# EAGLE design 2WLS-EXTENDER (EAGLE 7.4.0)
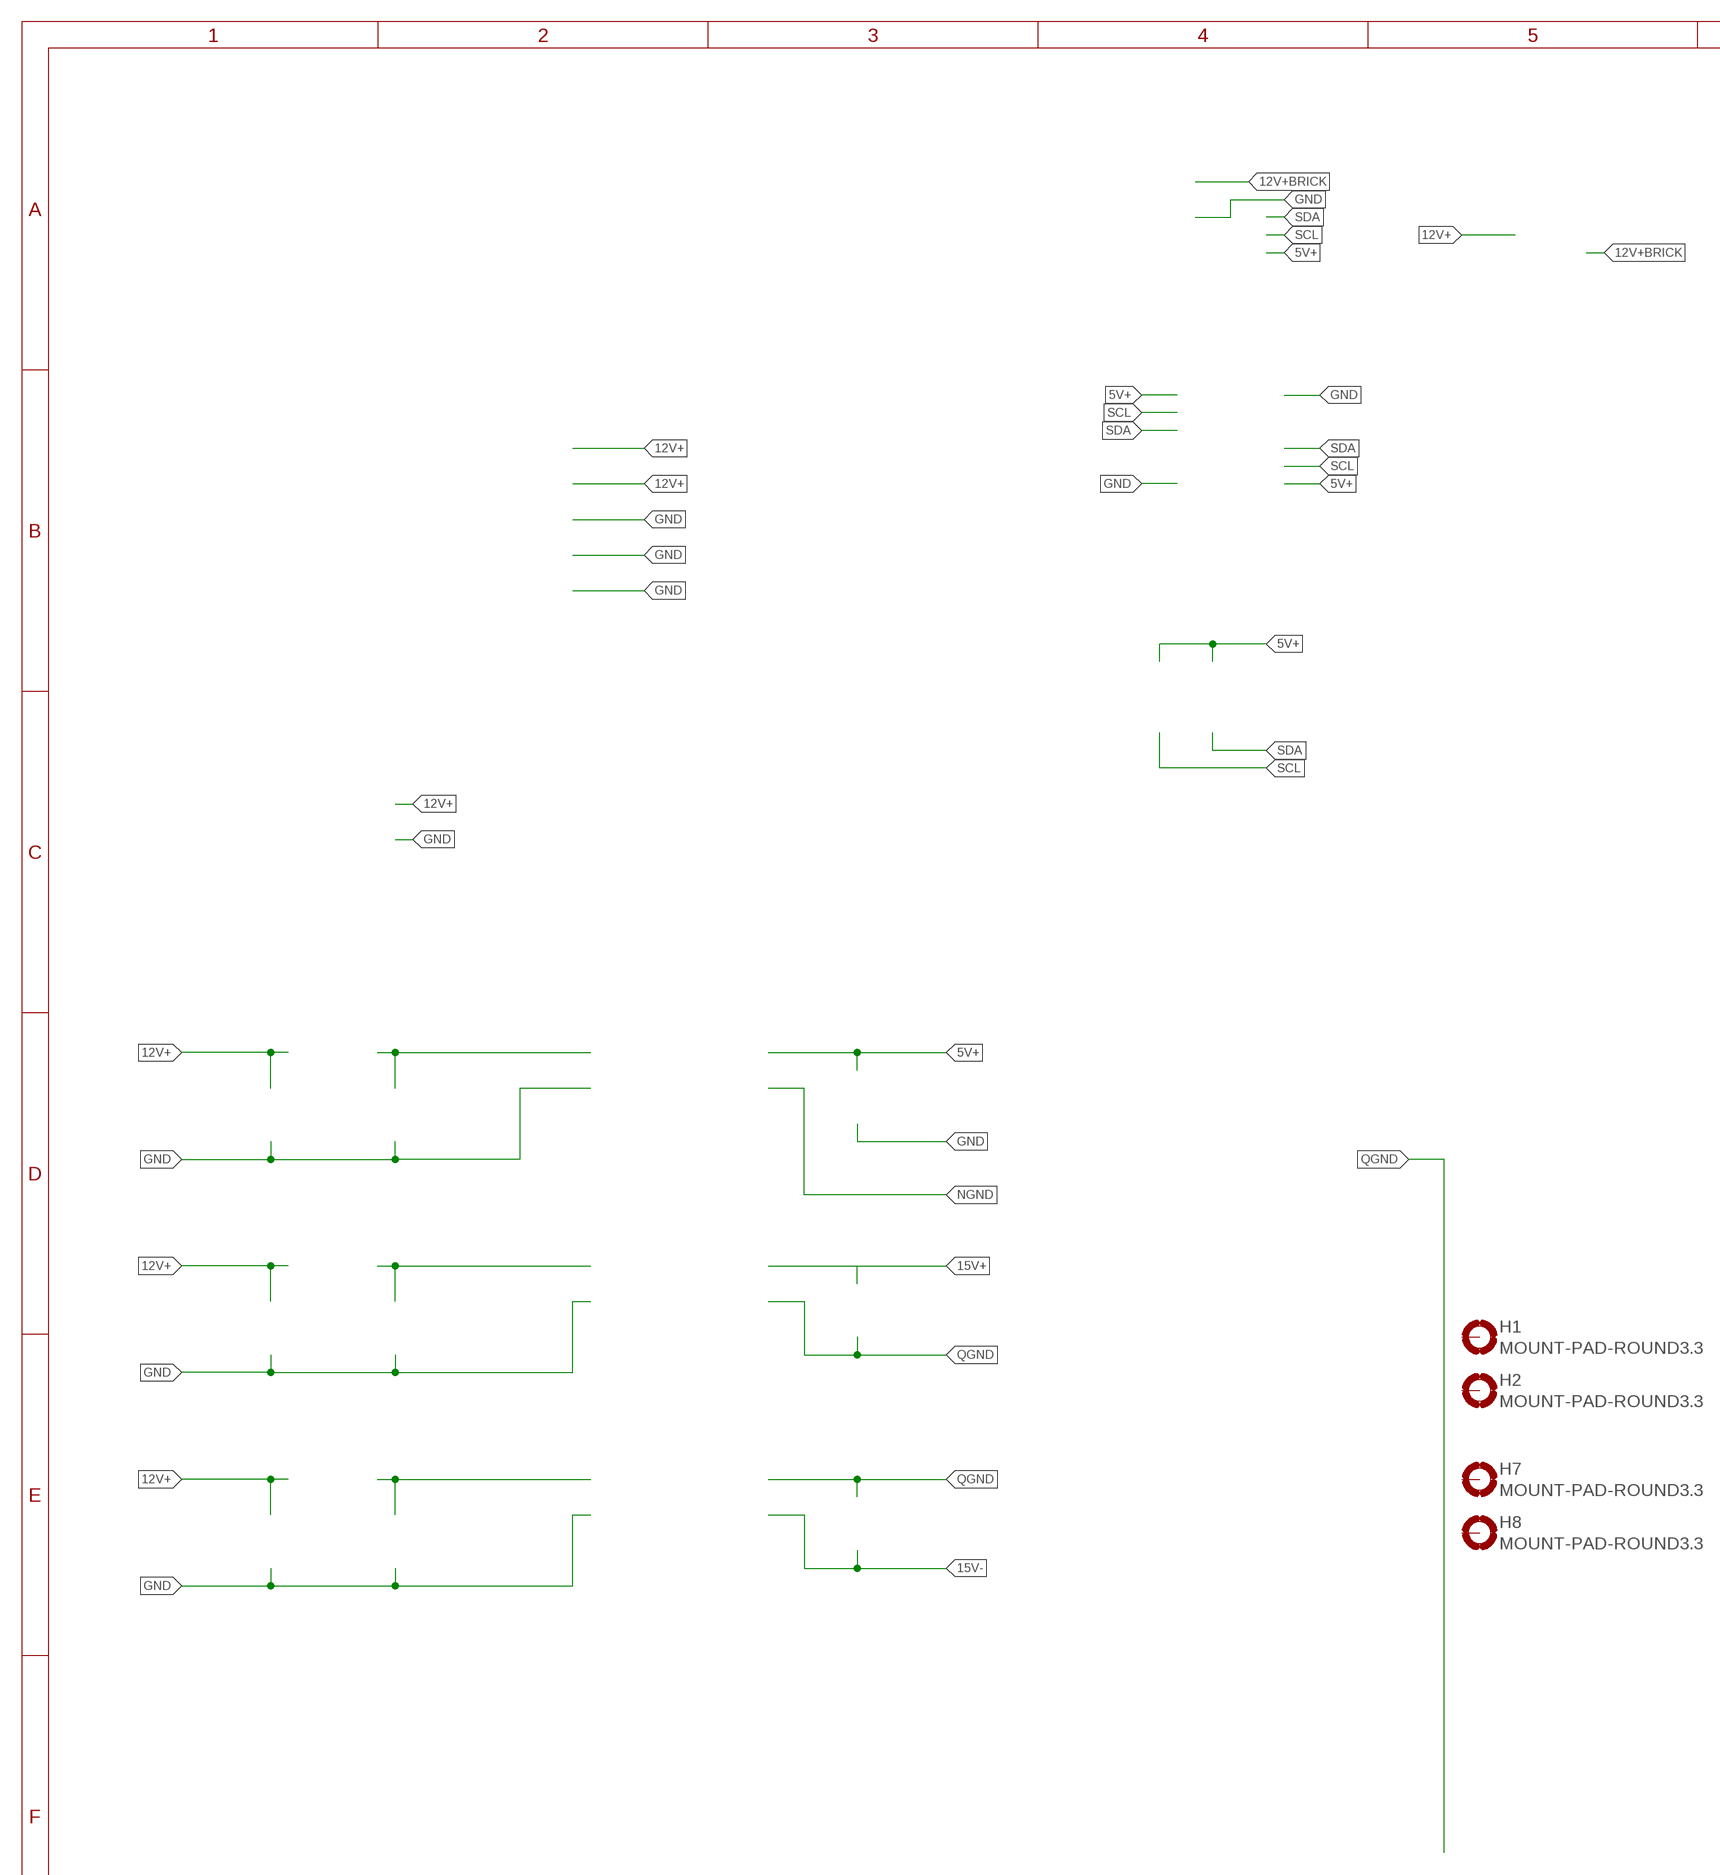
[diagram p0: schematic, sheet 1, part 1 of 2]
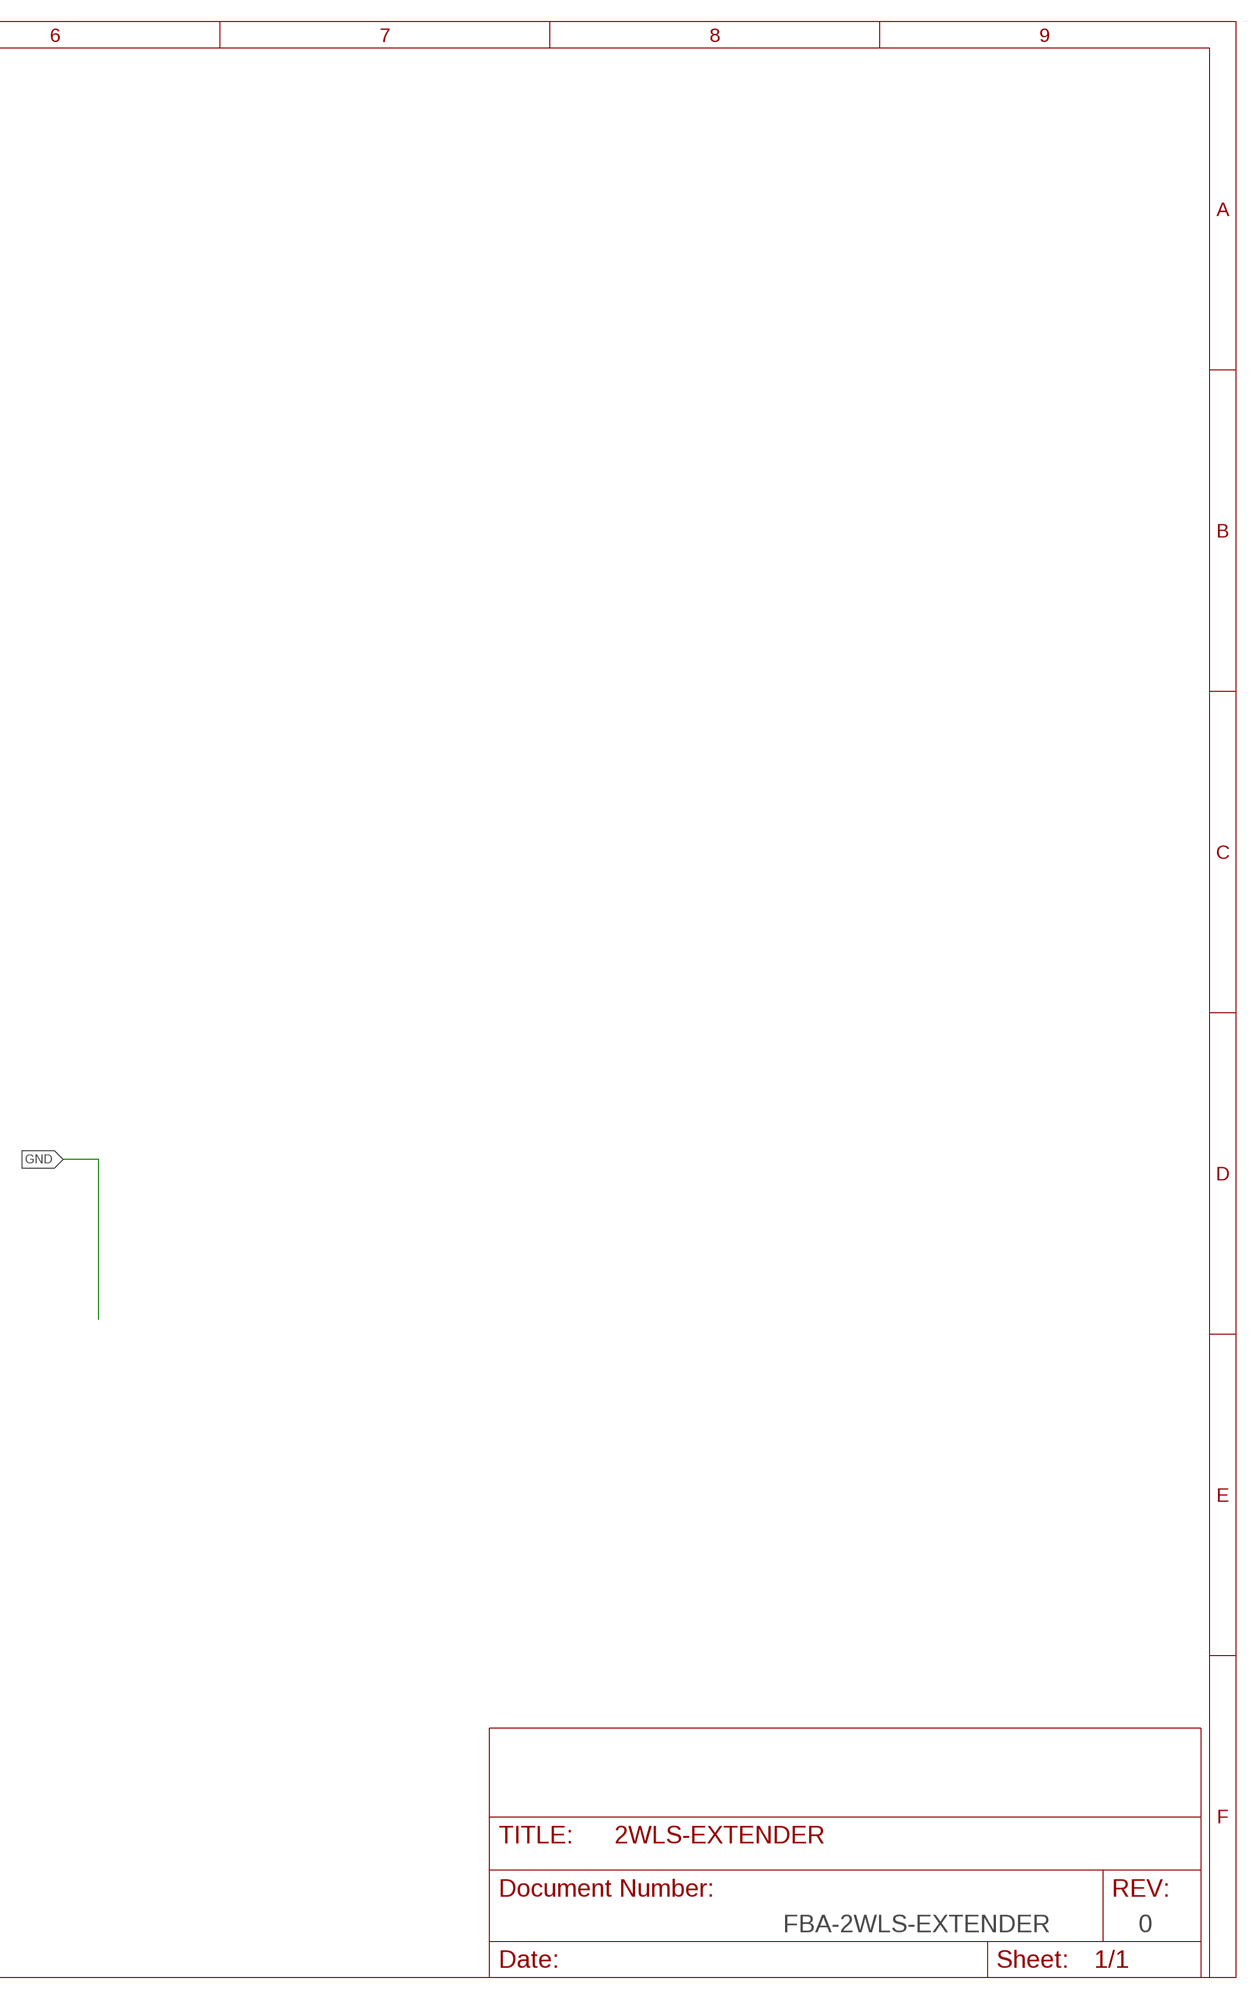
[diagram p1: schematic, sheet 1, part 2 of 2]

## Parts
H1  MOUNT-PAD-ROUND3.3  [3,3-PAD]
H2  MOUNT-PAD-ROUND3.3  [3,3-PAD]
H7  MOUNT-PAD-ROUND3.3  [3,3-PAD]
H8  MOUNT-PAD-ROUND3.3  [3,3-PAD]
Unconnected: H1.B3,3(MOUNT) H2.B3,3(MOUNT) H7.B3,3(MOUNT) H8.B3,3(MOUNT)

## Notes on the sheet
- FBA-2WLS-EXTENDER | 0

## Library data of the parts
H1 H2 H7 H8 = holes:MOUNT-PAD-ROUND: MOUNTING PAD, round

## Net classes
0 Signal: width 0.254 mm, clearance 0.205 mm
1 Power: width 0.508 mm, clearance 0.205 mm to class 0, clearance 0.205 mm
2 GND: width 0.889 mm

## Board
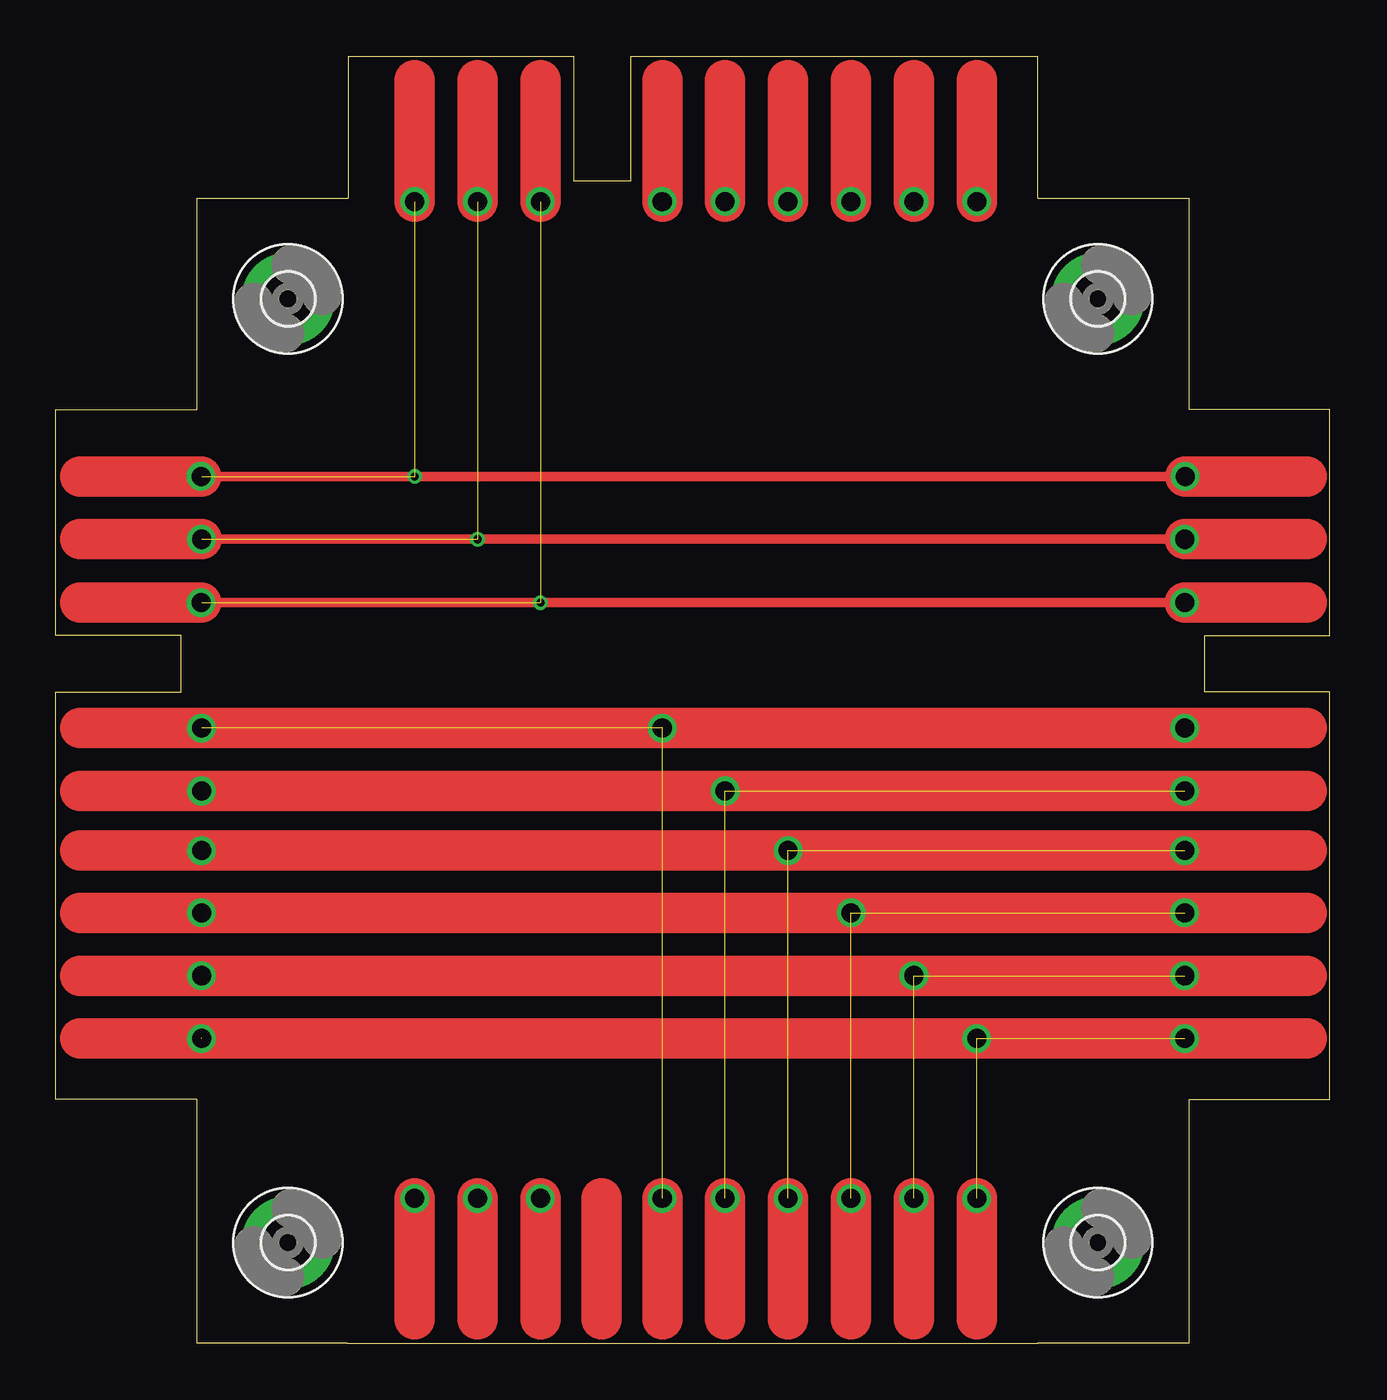
[diagram p2: board, top side]
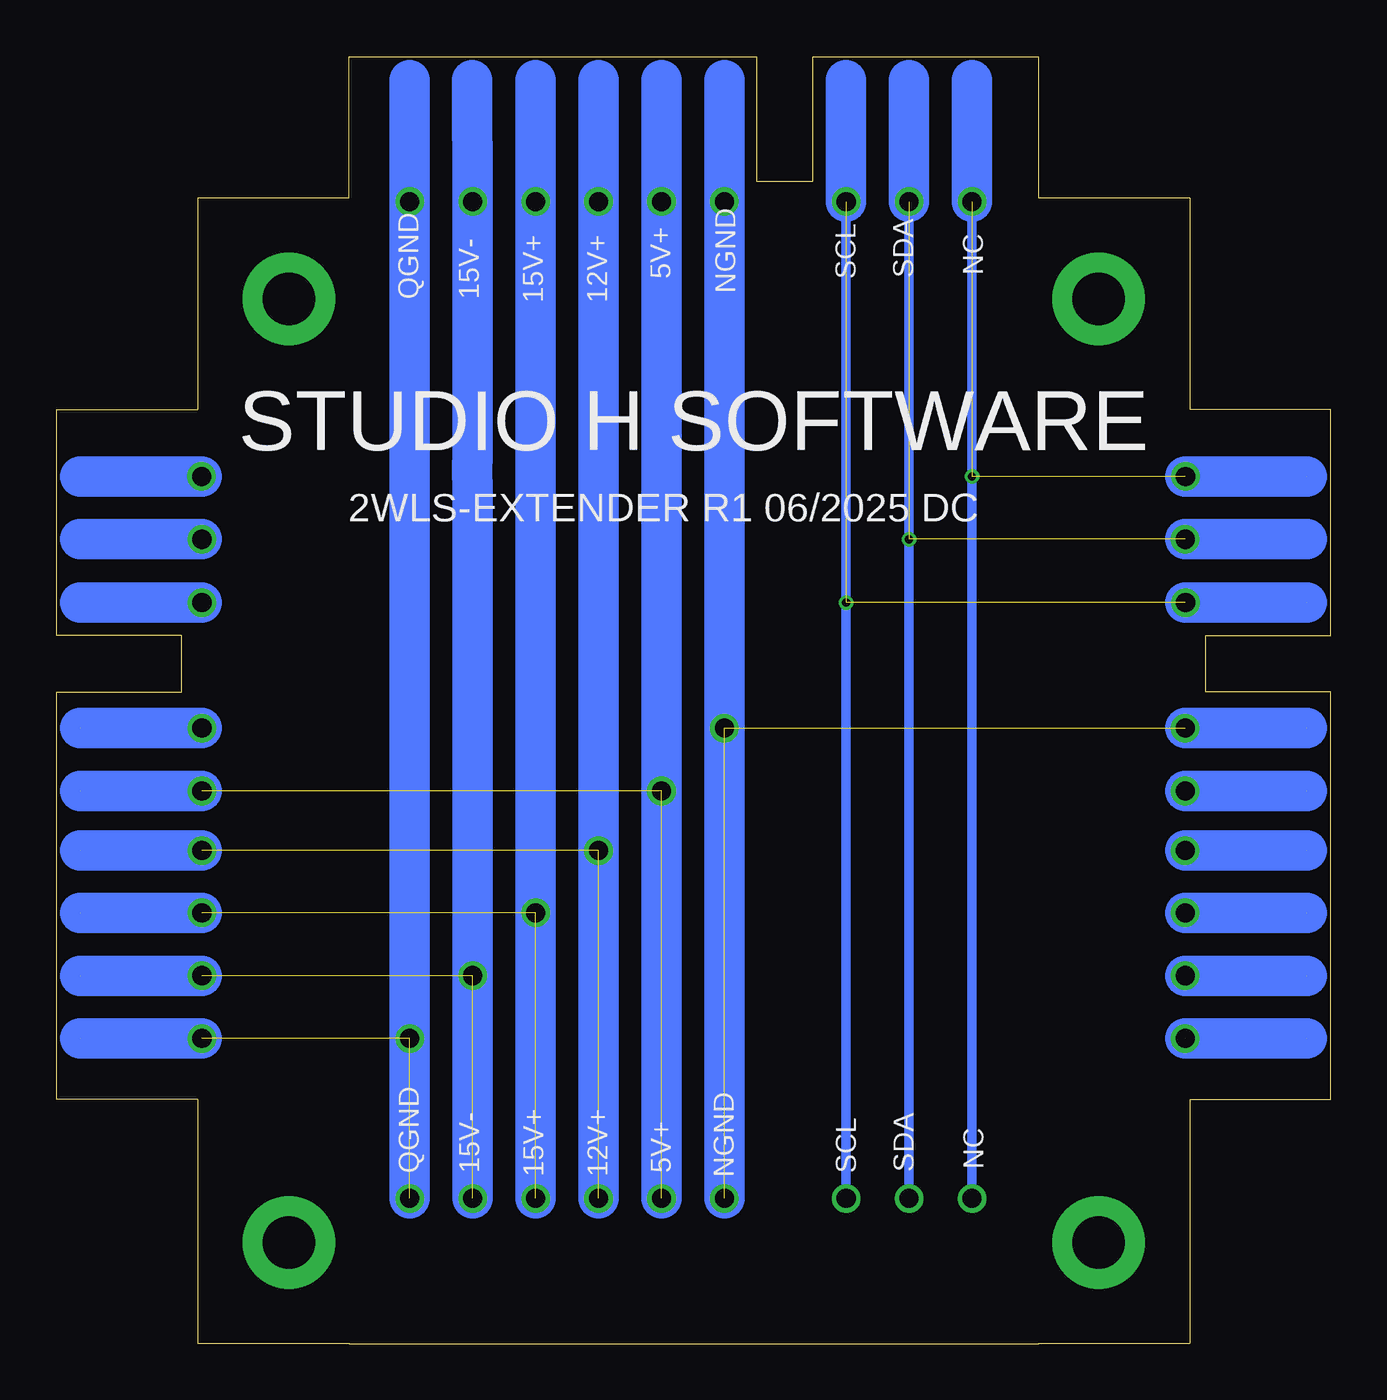
[diagram p3: board, bottom side, seen from below]

Size 80.24 x 81.04 mm. Coordinates in mm from the lower left corner, seen from the top.
Outline: 71.36,15.38 80.24,15.38 80.24,41.03 72.36,41.03 72.36,44.59 80.24,44.59 80.24,58.81 71.36,58.81 71.36,72.15 61.84,72.15 61.84,81.04 36.18,81.04 36.18,73.2 32.63,73.2 32.63,81.04 18.4,81.04 18.4,72.15 8.88,72.15 8.88,58.81 0,58.81 0,44.59 7.87,44.59 7.87,41.03 0,41.03 0,15.38 8.88,15.38 8.88,0.01 18.38,0.01 18.38,0 61.81,0 61.81,0.01 71.36,0.01 71.36,15.38
Copper layers (1*16): Top 0.035mm / dielectric 0.2mm / Bottom 0.035mm
Design rules "default *": minimum track width 10mil, minimum drill 20mil, track to track 8mil, track to pad 8mil, pad to pad 8mil, via to via 8mil, smd to smd 8mil, copper to edge 40mil, drill to drill 8mil, minimum pad ring 10mil, minimum via ring 8mil, stop-mask expansion 4mil, vias tented up to drill 0mil, thermal gap 10mil

### Footprints (pad centres in the part's own frame; a part is rotated, then mirrored left to right if it is on the bottom)
3,3-PAD = drill 3.3 pad 5.842: B3,3 0,0

### Placement (x,y rotation side)
H1  65.62,65.8 0 top
H2  65.62,6.36 0 top
H7  14.62,65.8 0 top
H8  14.62,6.36 0 top

### Tracks (layer width: path | path; a pad name or v marks a point on that pad's centre or on a via)
5V+  (via drill 1.2)  (4 unrouted)
  Top 2.54: v42.15,9.14 42.15,1.52 | v42.15,71.93 42.15,79.59 | 78.77,34.81 1.52,34.81
  Bottom 2.54: 42.15,79.59 v42.15,71.93 v42.15,9.14 | v71.09,34.81 78.77,34.81 | v9.17,34.81 1.52,34.81
  other vias: 42.15,34.81
12V+  (via drill 1.2)  (4 unrouted)
  Top 2.54: v46.11,9.14 46.11,1.52 | v46.11,71.93 46.11,79.59 | 78.77,31.05 1.52,31.05
  Bottom 2.54: 46.11,79.59 v46.11,71.93 v46.11,9.14 | v71.09,31.05 78.77,31.05 | v9.17,31.05 1.52,31.05
  other vias: 46.11,31.05
15V+  (via drill 1.2)  (4 unrouted)
  Top 2.54: v50.08,9.14 50.08,1.52 | v50.08,71.93 50.08,79.59 | 78.77,27.14 1.52,27.14
  Bottom 2.54: v9.17,27.14 1.52,27.14 | 50.08,79.59 v50.08,71.93 v50.08,9.14 | v71.09,27.14 78.77,27.14
  other vias: 50.08,27.14
15V-  (via drill 1.2)  (4 unrouted)
  Top 2.54: v54.04,9.14 54.04,1.52 | v54.04,71.93 54.04,79.59 | 78.77,23.18 1.52,23.18
  Bottom 0.61: 54.04,50.66 54.19,50.66 54.19,53.35 54.04,53.35 | 54.04,55.61 v54.04,9.14
  Bottom 2.54: v9.17,23.18 1.52,23.18 | 54.06,79.59 v54.04,71.93 54.04,55.61 | v54.04,9.14 54.04,50.66 54.04,53.35 54.06,55.46 | v71.09,23.18 78.77,23.18
  other vias: 54.04,23.18
N$1
  Top 2.54: 34.35,9.14 34.35,1.52
NC  (via drill 0.51, 1.2)  (3 unrouted)
  Top 0.61: v71.12,54.62 v9.14,54.62
  Top 2.54: v71.12,54.62 78.77,54.62 | v22.59,9.14 22.59,1.52 | v22.59,71.93 22.59,79.59 | v9.14,54.62 1.52,54.62
  Bottom 0.61: v22.59,71.93 v22.59,9.14
  Bottom 2.54: 9.17,54.62 1.52,54.62 | v22.59,71.93 22.59,79.59 | v71.12,54.62 78.77,54.62
  other vias: 22.59,54.62
NGND  (via drill 1.2)  (4 unrouted)
  Top 2.54: v38.19,9.14 38.19,1.52 | v38.19,71.93 38.19,79.59 | 78.77,38.77 1.52,38.77
  Bottom 2.54: v9.17,38.77 1.52,38.77 | 38.19,79.59 v38.19,71.93 v38.19,9.14 | v71.09,38.77 78.77,38.77
  other vias: 38.19,38.77
QGND  (via drill 1.2)  (5 unrouted)
  Top 2.54: v58,9.14 58,1.52 | 58,79.59 v58,71.93 | 78.77,19.21 1.52,19.21
  Bottom 2.54: 58,79.59 v58,71.93 v58,9.14 | 78.77,19.21 v71.09,19.21 | 9.14,19.21 1.52,19.21
  other vias: 9.17,19.22 58,19.22
SCL  (via drill 0.51, 1.2)  (3 unrouted)
  Top 0.61: v71.09,46.67 v9.14,46.67
  Top 2.54: v71.09,46.67 78.77,46.67 | v30.52,71.93 30.52,79.59 | v9.14,46.67 1.52,46.67 | v30.52,9.14 30.52,1.52
  Bottom 0.61: v30.52,9.14 v30.52,71.93
  Bottom 2.54: 9.17,46.67 1.52,46.67 | v30.52,71.93 30.52,79.59 | v71.09,46.67 78.77,46.67
  other vias: 30.52,46.67
SDA  (via drill 0.51, 1.2)  (2 unrouted)
  Top 0.61: v71.09,50.66 v9.17,50.66
  Top 2.54: v26.56,9.14 26.56,1.52 | v26.56,71.93 26.56,79.59 | v9.17,50.66 1.52,50.66 | v71.09,50.66 78.77,50.66
  Bottom 0.61: v26.56,9.14 v26.56,71.93
  Bottom 2.54: v26.56,71.93 26.56,79.59 | v71.09,50.66 78.77,50.66 | v9.17,50.66 1.52,50.66
  other vias: 26.56,50.66

### Text on the board
bNames: NC | SDA | SCL | 5V+ | NGND | 15V- | 12V+ | 15V+ | QGND | STUDIO H SOFTWARE | 2WLS-EXTENDER R1 06/2025 DC | NC | SDA | SCL | NGND | 5V+ | 12V+ | 15V+ | 15V- | QGND